# Altium schematic sheet Top Level.SchDoc
size A; SheetNumber: 1; SheetTotal: 4
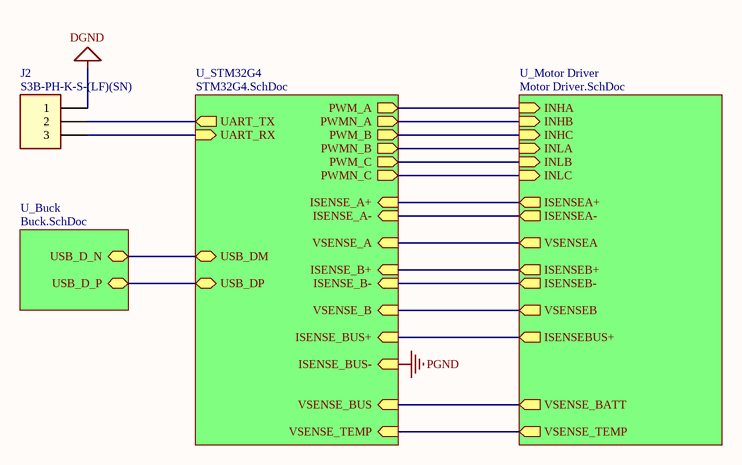
[diagram p0: Top Level.SchDoc]

## Parts
J2  S3B-PH-K-S-(LF)(SN)  [CONN-TH_3P-P2.00_S3B-PH-K-S-LF-SN]

## Sub-sheets
U_Buck = Buck.SchDoc: USB_D_P (bidir), USB_D_N (bidir)
U_Motor Driver = Motor Driver.SchDoc: INHA (in), INHB (in), INHC (in), INLA (in), INLB (in), INLC (in), VSENSE_TEMP (out), ISENSEA+ (out), ISENSEA- (out), ISENSEB+ (out), ISENSEB- (out), VSENSEA (out), VSENSEB (out), VSENSE_BATT (out), ISENSEBUS+ (out)
U_STM32G4 = STM32G4.SchDoc: ISENSE_A+ (in), ISENSE_A- (in), ISENSE_B+ (in), ISENSE_B- (in), ISENSE_BUS+ (in), VSENSE_A (in), VSENSE_B (in), VSENSE_BUS (in), VSENSE_TEMP (in), UART_TX (out), UART_RX (in), USB_DP (bidir), USB_DM (bidir), PWM_A (out), PWMN_A (out), PWM_B (out), PWMN_B (out), PWM_C (out), PWMN_C (out), ISENSE_BUS- (in)

## Nets
DGND: J2.1
PGND: sheet U_STM32G4/ISENSE_BUS-
NetJ2_2: J2.2 ; sheet U_STM32G4/UART_TX
NetJ2_3: J2.3 ; sheet U_STM32G4/UART_RX
(unnamed): sheet U_STM32G4/ISENSE_A+, sheet U_Motor Driver/ISENSEA+
(unnamed): sheet U_STM32G4/ISENSE_A-, sheet U_Motor Driver/ISENSEA-
(unnamed): sheet U_STM32G4/ISENSE_B+, sheet U_Motor Driver/ISENSEB+
(unnamed): sheet U_STM32G4/ISENSE_B-, sheet U_Motor Driver/ISENSEB-
(unnamed): sheet U_STM32G4/ISENSE_BUS+, sheet U_Motor Driver/ISENSEBUS+
(unnamed): sheet U_STM32G4/VSENSE_A, sheet U_Motor Driver/VSENSEA
(unnamed): sheet U_STM32G4/VSENSE_B, sheet U_Motor Driver/VSENSEB
(unnamed): sheet U_STM32G4/VSENSE_BUS, sheet U_Motor Driver/VSENSE_BATT
(unnamed): sheet U_STM32G4/VSENSE_TEMP, sheet U_Motor Driver/VSENSE_TEMP
(unnamed): sheet U_STM32G4/USB_DP, sheet U_Buck/USB_D_P
(unnamed): sheet U_STM32G4/USB_DM, sheet U_Buck/USB_D_N
(unnamed): sheet U_STM32G4/PWM_A, sheet U_Motor Driver/INHA
(unnamed): sheet U_STM32G4/PWMN_A, sheet U_Motor Driver/INHB
(unnamed): sheet U_STM32G4/PWM_B, sheet U_Motor Driver/INHC
(unnamed): sheet U_STM32G4/PWMN_B, sheet U_Motor Driver/INLA
(unnamed): sheet U_STM32G4/PWM_C, sheet U_Motor Driver/INLB
(unnamed): sheet U_STM32G4/PWMN_C, sheet U_Motor Driver/INLC

## Library data of the parts
J2 = S3B-PH-K-S-(LF)(SN): 3P 1x3P PH Tin -25℃~+85℃ White 2mm 100V 3 2A 1 Right Angle Through Hole,Right Angle,P=2mm Headers, Male Pins RoHS; Manu Part #: S3B-PH-K-S-(LF)(SN); LCSC Part #: C157929